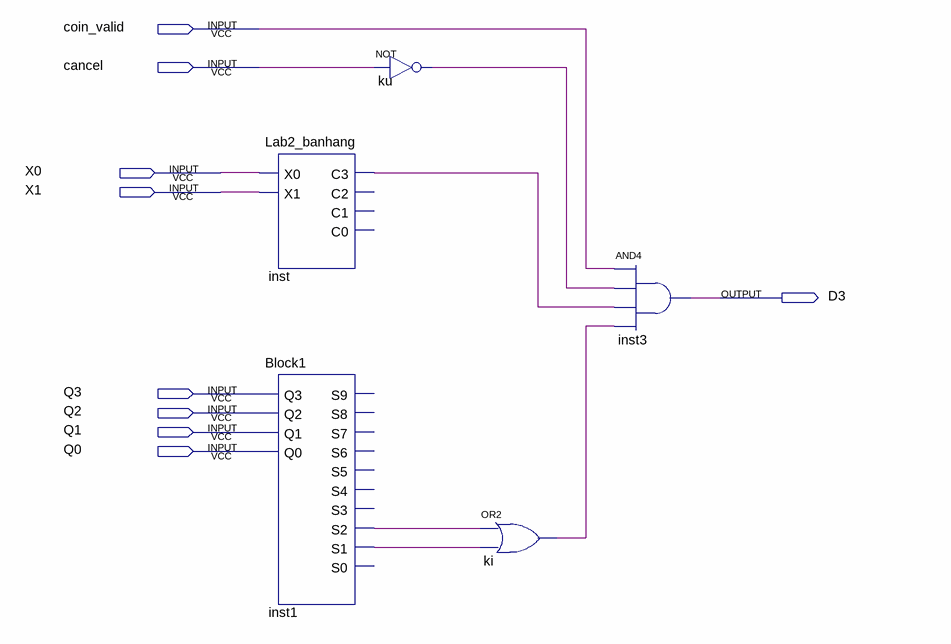
[diagram p0: schematic sheet]
// Quartus schematic Block5.bdf as structural Verilog: 5 symbols, 9 pins
module Block5 (
  input  coin_valid,
  input  cancel,
  input  X0,
  input  X1,
  input  Q3,
  input  Q2,
  input  Q1,
  input  Q0,
  output D3
);

  wire inst1_s1, inst1_s2, inst_c3, ki_out, ku_out;

  Lab2_banhang inst (.X0(X0), .X1(X1), .C3(inst_c3));  // open: C2, C1, C0
  Block1 inst1 (
    .Q3(Q3), .Q2(Q2), .Q1(Q1), .Q0(Q0), .S2(inst1_s2), .S1(inst1_s1));  // open: S9, S8, S7, S6, S5, S4, S3, S0
  not ku (ku_out, cancel);
  or ki (ki_out, inst1_s2, inst1_s1);
  and inst3 (D3, coin_valid, ku_out, inst_c3, ki_out);
endmodule
